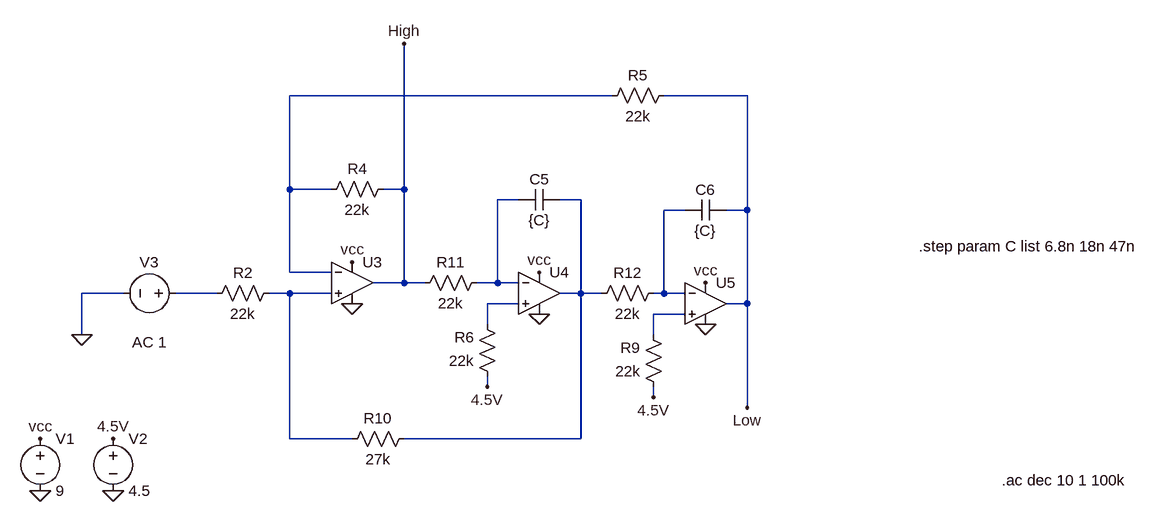
[diagram p0: schematic FrequencyResponse.asc]
FrequencyResponse.asc, the LTspice schematic file:
Version 4
SHEET 1 1876 1040
WIRE 304 336 -192 336
WIRE 512 336 384 336
WIRE -192 480 -192 336
WIRE -128 480 -192 480
WIRE -16 480 -16 256
WIRE -16 480 -48 480
WIRE 160 496 128 496
WIRE 256 496 224 496
WIRE 416 512 384 512
WIRE 512 512 512 336
WIRE 512 512 480 512
WIRE -192 608 -192 480
WIRE -128 608 -192 608
WIRE -16 624 -16 480
WIRE -16 624 -64 624
WIRE 16 624 -16 624
WIRE 128 624 128 496
WIRE 128 624 96 624
WIRE 160 624 128 624
WIRE -448 640 -512 640
WIRE -304 640 -368 640
WIRE -192 640 -224 640
WIRE -128 640 -192 640
WIRE 256 640 256 496
WIRE 256 640 224 640
WIRE 288 640 256 640
WIRE 384 640 384 512
WIRE 384 640 368 640
WIRE 416 640 384 640
WIRE 160 656 112 656
WIRE 512 656 512 512
WIRE 512 656 480 656
WIRE 416 672 368 672
WIRE 112 688 112 656
WIRE -512 704 -512 640
WIRE 368 704 368 672
WIRE 112 784 112 768
WIRE 368 800 368 784
WIRE 512 816 512 656
WIRE -192 864 -192 640
WIRE -96 864 -192 864
WIRE 256 864 256 640
WIRE 256 864 -16 864
FLAG -576 864 vcc
FLAG -576 944 0
FLAG -96 656 0
FLAG -96 592 vcc
FLAG 192 672 0
FLAG 192 608 vcc
FLAG 448 688 0
FLAG 448 624 vcc
FLAG 368 800 4.5V
FLAG 112 784 4.5V
FLAG 512 816 Low
FLAG -16 256 High
FLAG -464 944 0
FLAG -464 864 4.5V
FLAG -512 704 0
SYMBOL voltage -576 848 R0
WINDOW 123 0 0 Left 0
WINDOW 39 0 0 Left 0
SYMATTR InstName V1
SYMATTR Value 9
SYMBOL res -208 624 R90
WINDOW 0 0 56 VBottom 2
WINDOW 3 32 56 VTop 2
SYMATTR InstName R2
SYMATTR Value 22k
SYMBOL OpAmps\\UniversalOpAmp -96 624 R0
SYMATTR InstName U3
SYMBOL OpAmps\\UniversalOpAmp 192 640 R0
SYMATTR InstName U4
SYMBOL OpAmps\\UniversalOpAmp 448 656 R0
SYMATTR InstName U5
SYMBOL res -32 464 R90
WINDOW 0 0 56 VBottom 2
WINDOW 3 32 56 VTop 2
SYMATTR InstName R4
SYMATTR Value 22k
SYMBOL cap 224 480 R90
WINDOW 0 0 32 VBottom 2
WINDOW 3 32 32 VTop 2
SYMATTR InstName C5
SYMATTR Value {C}
SYMBOL cap 480 496 R90
WINDOW 0 0 32 VBottom 2
WINDOW 3 32 32 VTop 2
SYMATTR InstName C6
SYMATTR Value {C}
SYMBOL res 400 320 R90
WINDOW 0 0 56 VBottom 2
WINDOW 3 32 56 VTop 2
SYMATTR InstName R5
SYMATTR Value 22k
SYMBOL res 128 784 R180
WINDOW 0 36 76 Left 2
WINDOW 3 36 40 Left 2
SYMATTR InstName R6
SYMATTR Value 22k
SYMBOL res 384 800 R180
WINDOW 0 36 76 Left 2
WINDOW 3 36 40 Left 2
SYMATTR InstName R9
SYMATTR Value 22k
SYMBOL res -112 880 R270
WINDOW 0 32 56 VTop 2
WINDOW 3 0 56 VBottom 2
SYMATTR InstName R10
SYMATTR Value 27k
SYMBOL res 112 608 R90
WINDOW 0 0 56 VBottom 2
WINDOW 3 32 56 VTop 2
SYMATTR InstName R11
SYMATTR Value 22k
SYMBOL res 384 624 R90
WINDOW 0 0 56 VBottom 2
WINDOW 3 32 56 VTop 2
SYMATTR InstName R12
SYMATTR Value 22k
SYMBOL voltage -464 848 R0
WINDOW 123 0 0 Left 0
WINDOW 39 0 0 Left 0
SYMATTR InstName V2
SYMATTR Value 4.5
SYMBOL voltage -352 640 R90
WINDOW 0 -32 56 VBottom 2
WINDOW 3 32 56 VTop 2
WINDOW 123 60 56 VTop 2
WINDOW 39 0 0 Left 0
SYMATTR InstName V3
SYMATTR Value ""
SYMATTR Value2 AC 1
TEXT 904 928 Left 2 !.ac dec 10 1 100k
TEXT 776 568 Left 2 !.step param C list 6.8n 18n 47n

The netlist it stands for:
* FrequencyResponse.asc
V1 vcc 0 9
R2 N006 N005 22k
XU3 N006 N001 vcc 0 High level1 Avol=1Meg GBW=10Meg Vos=0 En=0 Enk=0 In=0 Ink=0 Rin=500Meg  ; pins In+ In- V+ V- OUT
XU4 N007 N002 vcc 0 N003 level1 Avol=1Meg GBW=10Meg Vos=0 En=0 Enk=0 In=0 Ink=0 Rin=500Meg  ; pins In+ In- V+ V- OUT
XU5 N008 N004 vcc 0 Low level1 Avol=1Meg GBW=10Meg Vos=0 En=0 Enk=0 In=0 Ink=0 Rin=500Meg  ; pins In+ In- V+ V- OUT
R4 High N001 22k
C5 N003 N002 {C}
C6 Low N004 {C}
R5 Low N001 22k
R6 4.5V N007 22k
R9 4.5V N008 22k
R10 N006 N003 27k
R11 N002 High 22k
R12 N004 N003 22k
V2 4.5V 0 4.5
V3 N005 0 AC 1
.ac dec 10 1 100k
.step param C list 6.8n 18n 47n
.lib UniversalOpAmp1.lib
.backanno
.end